# EAGLE design ALU_2 (EAGLE 5.11)
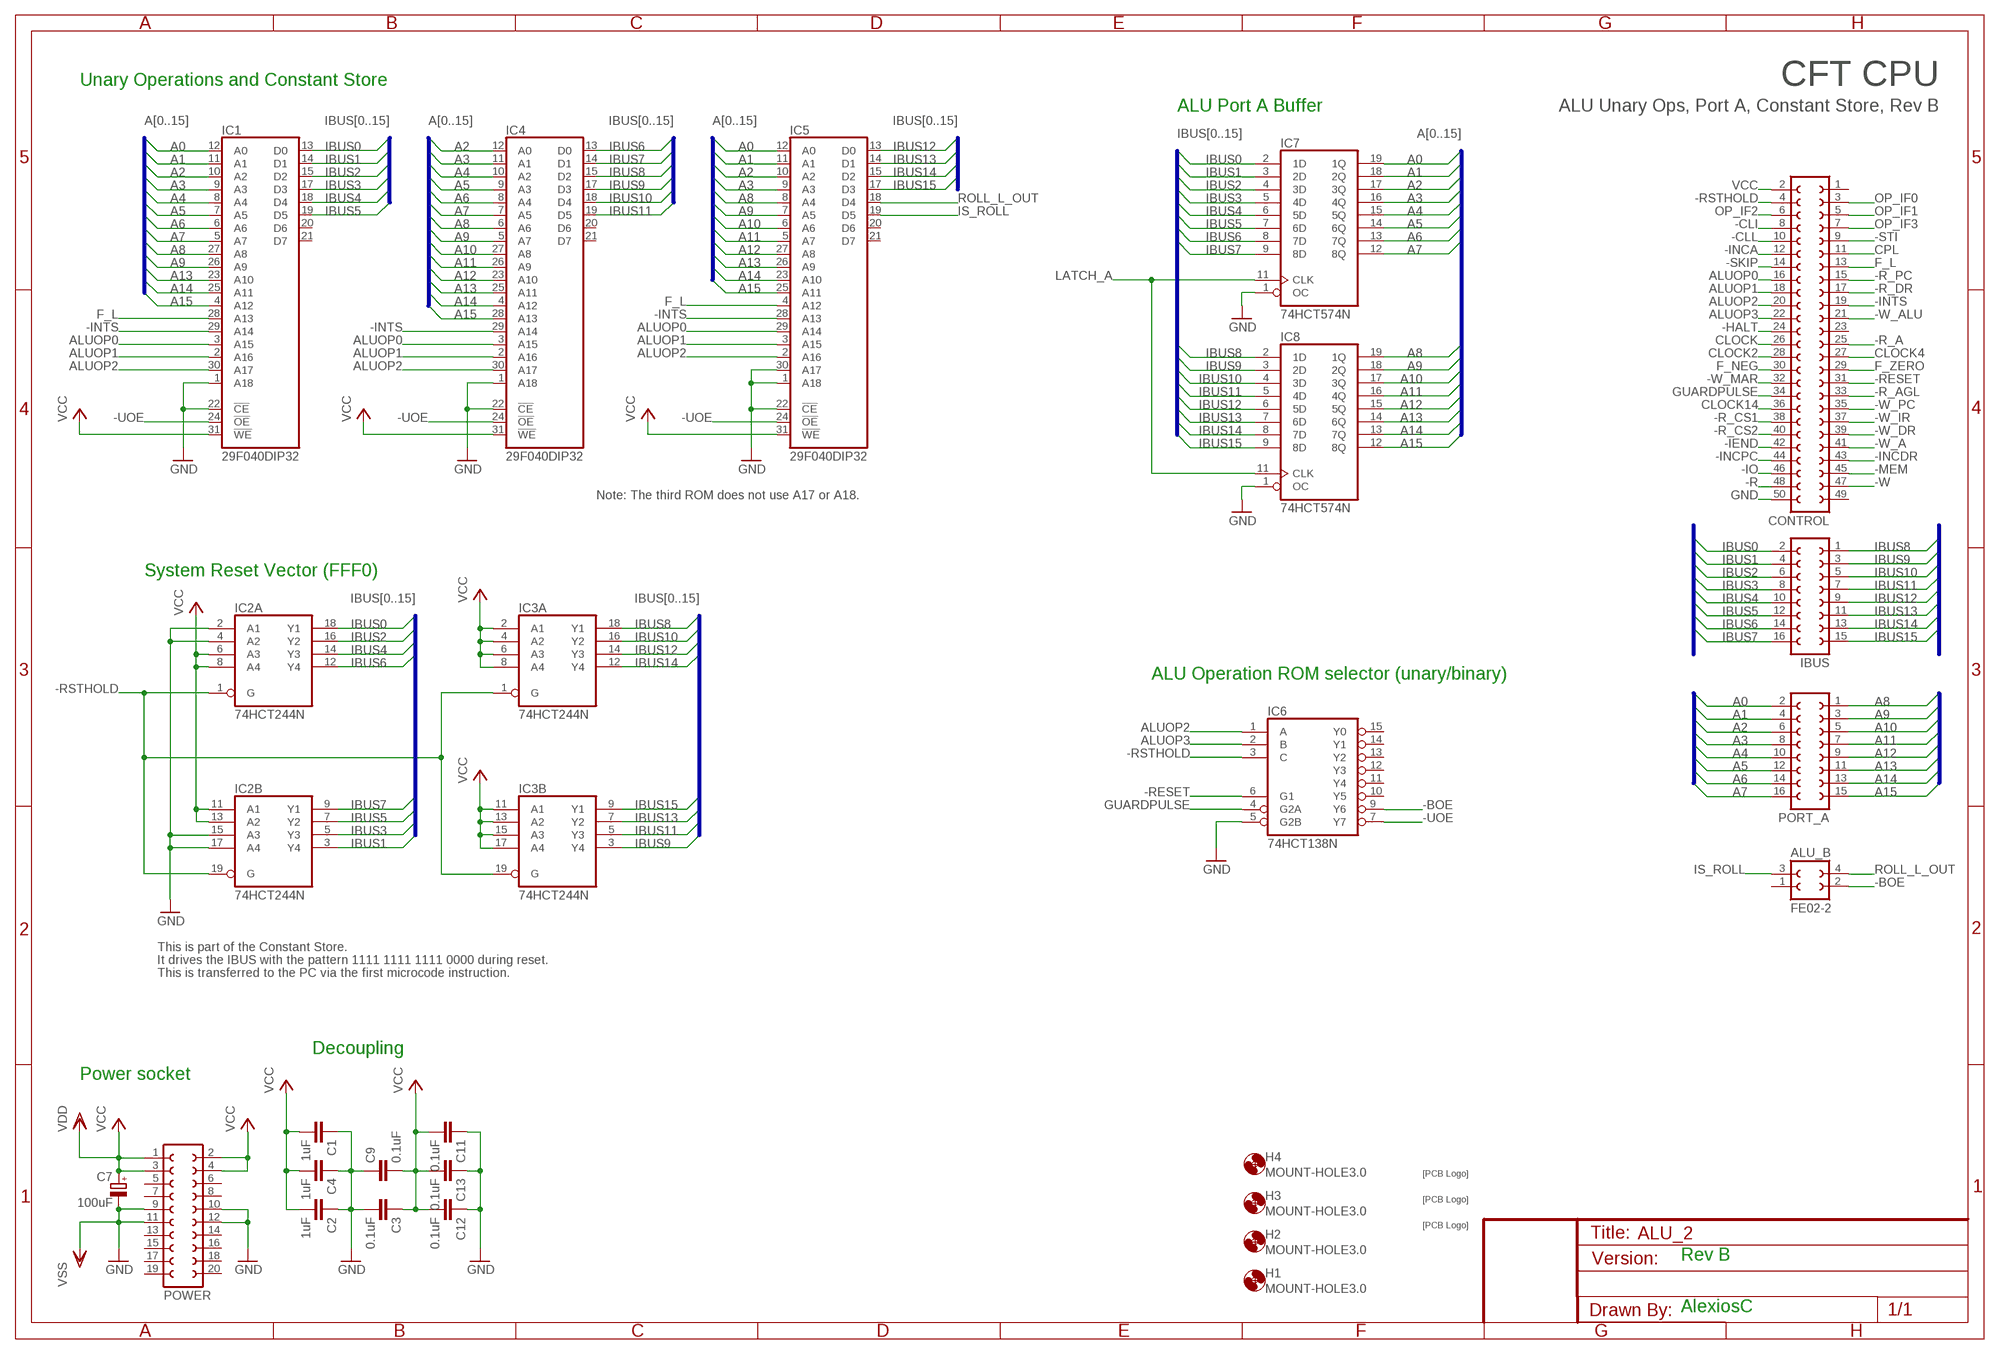
[diagram p0: schematic, sheet 1]

## Parts
ALU_B  FE02-2  [FE02-2]
C1  1uF  C-EU025-025X050  [C025-025X050]
C2  1uF  C-EU025-025X050  [C025-025X050]
C3  0.1uF  C-EU025-025X050  [C025-025X050]
C4  1uF  C-EU025-025X050  [C025-025X050]
C7  100uF  CPOL-EUE2.5-6  [E2,5-6]
C9  0.1uF  C-EU025-025X050  [C025-025X050]
C11  0.1uF  C-EU025-025X050  [C025-025X050]
C12  0.1uF  C-EU025-025X050  [C025-025X050]
C13  0.1uF  C-EU025-025X050  [C025-025X050]
CONTROL  FE25-2  [FE25-2]
H1  MOUNT-HOLE3.0  [3,0]
H2  MOUNT-HOLE3.0  [3,0]
H3  MOUNT-HOLE3.0  [3,0]
H4  MOUNT-HOLE3.0  [3,0]
IBUS  FE08-2  [FE08-2]
IC1  29F040DIP32  [DIL32]
IC2  74HCT244N  [DIL20]
IC3  74HCT244N  [DIL20]
IC4  29F040DIP32  [DIL32]
IC5  29F040DIP32  [DIL32]
IC6  74HCT138N  [DIL16]
IC7  74HCT574N  [DIL20]
IC8  74HCT574N  [DIL20]
PORT_A  FE08-2  [FE08-2]
POWER  FE10-2  [FE10-2]
U$1  SIGNATUREPLANE  [SIGNATURE_PLANE]
U$2  SIGNATUREPLANE  [SIGNATURE_PLANE]
U$3  SIGNATURESILK  [SIGNATURE]

## Nets
-BOE: ALU_B.2 IC6.9(Y6)
-CLI: CONTROL.8
-CLL: CONTROL.10
-HALT: CONTROL.24
-IEND: CONTROL.42
-INCA: CONTROL.12
-INCDR: CONTROL.43
-INCPC: CONTROL.44
-INTS: CONTROL.19 IC1.29(A14) IC4.29(A14) IC5.28(A13)
-IO: CONTROL.46
-MEM: CONTROL.45
-R: CONTROL.48
-R_A: CONTROL.25
-R_AGL: CONTROL.33
-R_CS1: CONTROL.38
-R_CS2: CONTROL.40
-R_DR: CONTROL.17
-R_PC: CONTROL.15
-RESET: CONTROL.31 IC6.6(G1)
-RSTHOLD: CONTROL.4 IC2.1(A:G) IC2.19(B:G) IC3.1(A:G) IC3.19(B:G) IC6.3(C)
-SKIP: CONTROL.14
-STI: CONTROL.9
-UOE: IC1.24(!OE) IC4.24(!OE) IC5.24(!OE) IC6.7(Y7)
-W: CONTROL.47
-W_A: CONTROL.41
-W_ALU: CONTROL.21
-W_DR: CONTROL.39
-W_IR: CONTROL.37
-W_MAR: CONTROL.32
-W_PC: CONTROL.35
A0: IC1.12(A0) IC5.12(A0) IC7.19(1Q) PORT_A.2
A1: IC1.11(A1) IC5.11(A1) IC7.18(2Q) PORT_A.4
A2: IC1.10(A2) IC4.12(A0) IC5.10(A2) IC7.17(3Q) PORT_A.6
A3: IC1.9(A3) IC4.11(A1) IC5.9(A3) IC7.16(4Q) PORT_A.8
A4: IC1.8(A4) IC4.10(A2) IC7.15(5Q) PORT_A.10
A5: IC1.7(A5) IC4.9(A3) IC7.14(6Q) PORT_A.12
A6: IC1.6(A6) IC4.8(A4) IC7.13(7Q) PORT_A.14
A7: IC1.5(A7) IC4.7(A5) IC7.12(8Q) PORT_A.16
A8: IC1.27(A8) IC4.6(A6) IC5.8(A4) IC8.19(1Q) PORT_A.1
A9: IC1.26(A9) IC4.5(A7) IC5.7(A5) IC8.18(2Q) PORT_A.3
A10: IC4.27(A8) IC5.6(A6) IC8.17(3Q) PORT_A.5
A11: IC4.26(A9) IC5.5(A7) IC8.16(4Q) PORT_A.7
A12: IC4.23(A10) IC5.27(A8) IC8.15(5Q) PORT_A.9
A13: IC1.23(A10) IC4.25(A11) IC5.26(A9) IC8.14(6Q) PORT_A.11
A14: IC1.25(A11) IC4.4(A12) IC5.23(A10) IC8.13(7Q) PORT_A.13
A15: IC1.4(A12) IC4.28(A13) IC5.25(A11) IC8.12(8Q) PORT_A.15
ALUOP0: CONTROL.16 IC1.3(A15) IC4.3(A15) IC5.29(A14)
ALUOP1: CONTROL.18 IC1.2(A16) IC4.2(A16) IC5.3(A15)
ALUOP2: CONTROL.20 IC1.30(A17) IC4.30(A17) IC5.2(A16) IC6.1(A)
ALUOP3: CONTROL.22 IC6.2(B)
CLOCK: CONTROL.26
CLOCK2: CONTROL.28
CLOCK4: CONTROL.27
CLOCK14: CONTROL.36
CPL: CONTROL.11
F_L: CONTROL.13 IC1.28(A13) IC5.4(A12)
F_NEG: CONTROL.30
F_ZERO: CONTROL.29
GND: C1.1 C2.1 C3.2 C4.1 C7.- C9.1 C11.1 C12.1 C13.1 CONTROL.50 IC1.1(A18) IC1.22(!CE) IC2.2(A:A1) IC2.4(A:A2) IC2.15(B:A3) IC2.17(B:A4) IC4.1(A18) IC4.22(!CE) IC5.1(A18) IC5.22(!CE) IC5.30(A17) IC6.5(G2B) IC7.1(OC) IC8.1(OC) POWER.9 POWER.10 POWER.11 POWER.12 ; supply symbol labelled VSS
GUARDPULSE: CONTROL.34 IC6.4(G2A)
IBUS0: IBUS.2 IC1.13(D0) IC2.18(A:Y1) IC7.2(1D)
IBUS1: IBUS.4 IC1.14(D1) IC2.3(B:Y4) IC7.3(2D)
IBUS2: IBUS.6 IC1.15(D2) IC2.16(A:Y2) IC7.4(3D)
IBUS3: IBUS.8 IC1.17(D3) IC2.5(B:Y3) IC7.5(4D)
IBUS4: IBUS.10 IC1.18(D4) IC2.14(A:Y3) IC7.6(5D)
IBUS5: IBUS.12 IC1.19(D5) IC2.7(B:Y2) IC7.7(6D)
IBUS6: IBUS.14 IC2.12(A:Y4) IC4.13(D0) IC7.8(7D)
IBUS7: IBUS.16 IC2.9(B:Y1) IC4.14(D1) IC7.9(8D)
IBUS8: IBUS.1 IC3.18(A:Y1) IC4.15(D2) IC8.2(1D)
IBUS9: IBUS.3 IC3.3(B:Y4) IC4.17(D3) IC8.3(2D)
IBUS10: IBUS.5 IC3.16(A:Y2) IC4.18(D4) IC8.4(3D)
IBUS11: IBUS.7 IC3.5(B:Y3) IC4.19(D5) IC8.5(4D)
IBUS12: IBUS.9 IC3.14(A:Y3) IC5.13(D0) IC8.6(5D)
IBUS13: IBUS.11 IC3.7(B:Y2) IC5.14(D1) IC8.7(6D)
IBUS14: IBUS.13 IC3.12(A:Y4) IC5.15(D2) IC8.8(7D)
IBUS15: IBUS.15 IC3.9(B:Y1) IC5.17(D3) IC8.9(8D)
IS_ROLL: ALU_B.3 IC5.19(D5)
LATCH_A: IC7.11(CLK) IC8.11(CLK)
OP_IF0: CONTROL.3
OP_IF1: CONTROL.5
OP_IF2: CONTROL.6
OP_IF3: CONTROL.7
ROLL_L_OUT: ALU_B.4 IC5.18(D4)
VCC: C1.2 C2.2 C3.1 C4.2 C7.+ C9.2 C11.2 C12.2 C13.2 CONTROL.2 IC1.31(!WE) IC2.6(A:A3) IC2.8(A:A4) IC2.11(B:A1) IC2.13(B:A2) IC3.2(A:A1) IC3.4(A:A2) IC3.6(A:A3) IC3.8(A:A4) IC3.11(B:A1) IC3.13(B:A2) IC3.15(B:A3) IC3.17(B:A4) IC4.31(!WE) IC5.31(!WE) POWER.1 POWER.2 POWER.3 POWER.4 ; supply symbol labelled VDD
Unconnected: ALU_B.1 CONTROL.1 CONTROL.23 CONTROL.49 IC1.20(D6) IC1.21(D7) IC4.20(D6) IC4.21(D7) IC5.20(D6) IC5.21(D7) IC6.10(Y5) IC6.11(Y4) IC6.12(Y3) IC6.13(Y2) IC6.14(Y1) IC6.15(Y0) POWER.5 POWER.6 POWER.7 POWER.8 POWER.13 POWER.14 POWER.15 POWER.16 POWER.17 POWER.18 POWER.19 POWER.20

## Buses
IBUS[0..15]
A[0..15]

## Notes on the sheet
- Unary Operations and Constant Store | CFT CPU
- ALU Port A Buffer | ALU Unary Ops, Port A, Constant Store, Rev B
- Note: The third ROM does not use A17 or A18.
- System Reset Vector (FFF0)
- ALU Operation ROM selector (unary/binary)
- This is part of the Constant Store.
- It drives the IBUS with the pattern 1111 1111 1111 0000 during reset.
- This is transferred to the PC via the first microcode instruction.
- Decoupling
- Power socket
- Rev B
- AlexiosC

## Power pins joined to a net without a drawn wire
GND: IC1.16(GND) IC2.10(P:GND) IC3.10(P:GND) IC4.16(GND) IC5.16(GND) IC6.8(GND) IC7.10(GND) IC8.10(GND)
VCC: IC1.32(VCC) IC2.20(P:VCC) IC3.20(P:VCC) IC4.32(VCC) IC5.32(VCC) IC6.16(VCC) IC7.20(VCC) IC8.20(VCC)

## Library data of the parts
ALU_B = alexios:FE02-2: A 2x2 pin female header.
C1-C4 C9 C11-C13 = rcl:C-EU: CAPACITOR, European symbol
C7 = rcl:CPOL-EU: POLARIZED CAPACITOR, European symbol
CONTROL = con-lsta:FE25-2: FEMALE HEADER
H1-H4 = holes:MOUNT-HOLE: MOUNTING HOLE with drill center marker
IBUS PORT_A = con-lsta:FE08-2: FEMALE HEADER
IC1 IC4 IC5 = alexios:29F040: 4-mbit (512x8) Flash memory in a PLCC32 package (with socket). AM29F040 is an example of this.
IC2 IC3 = 74xx-eu:74*244: Octal BUFFER and LINE DRIVER, 3-state
IC6 = 74xx-eu:74*138: 3-line to 8-line DECODER/DEMULTIPLEXER
IC7 IC8 = 74xx-eu:74*574: 8-bit D type FLIP FLOP bus driver
POWER = con-lsta:FE10-2: FEMALE HEADER; OC_FARNELL: unknown; OC_NEWARK: unknown
U$1-U$3 = alexios:SIGNATURE: Soup signature

## Net classes
1 Decoupling: width 1.27 mm

## Board
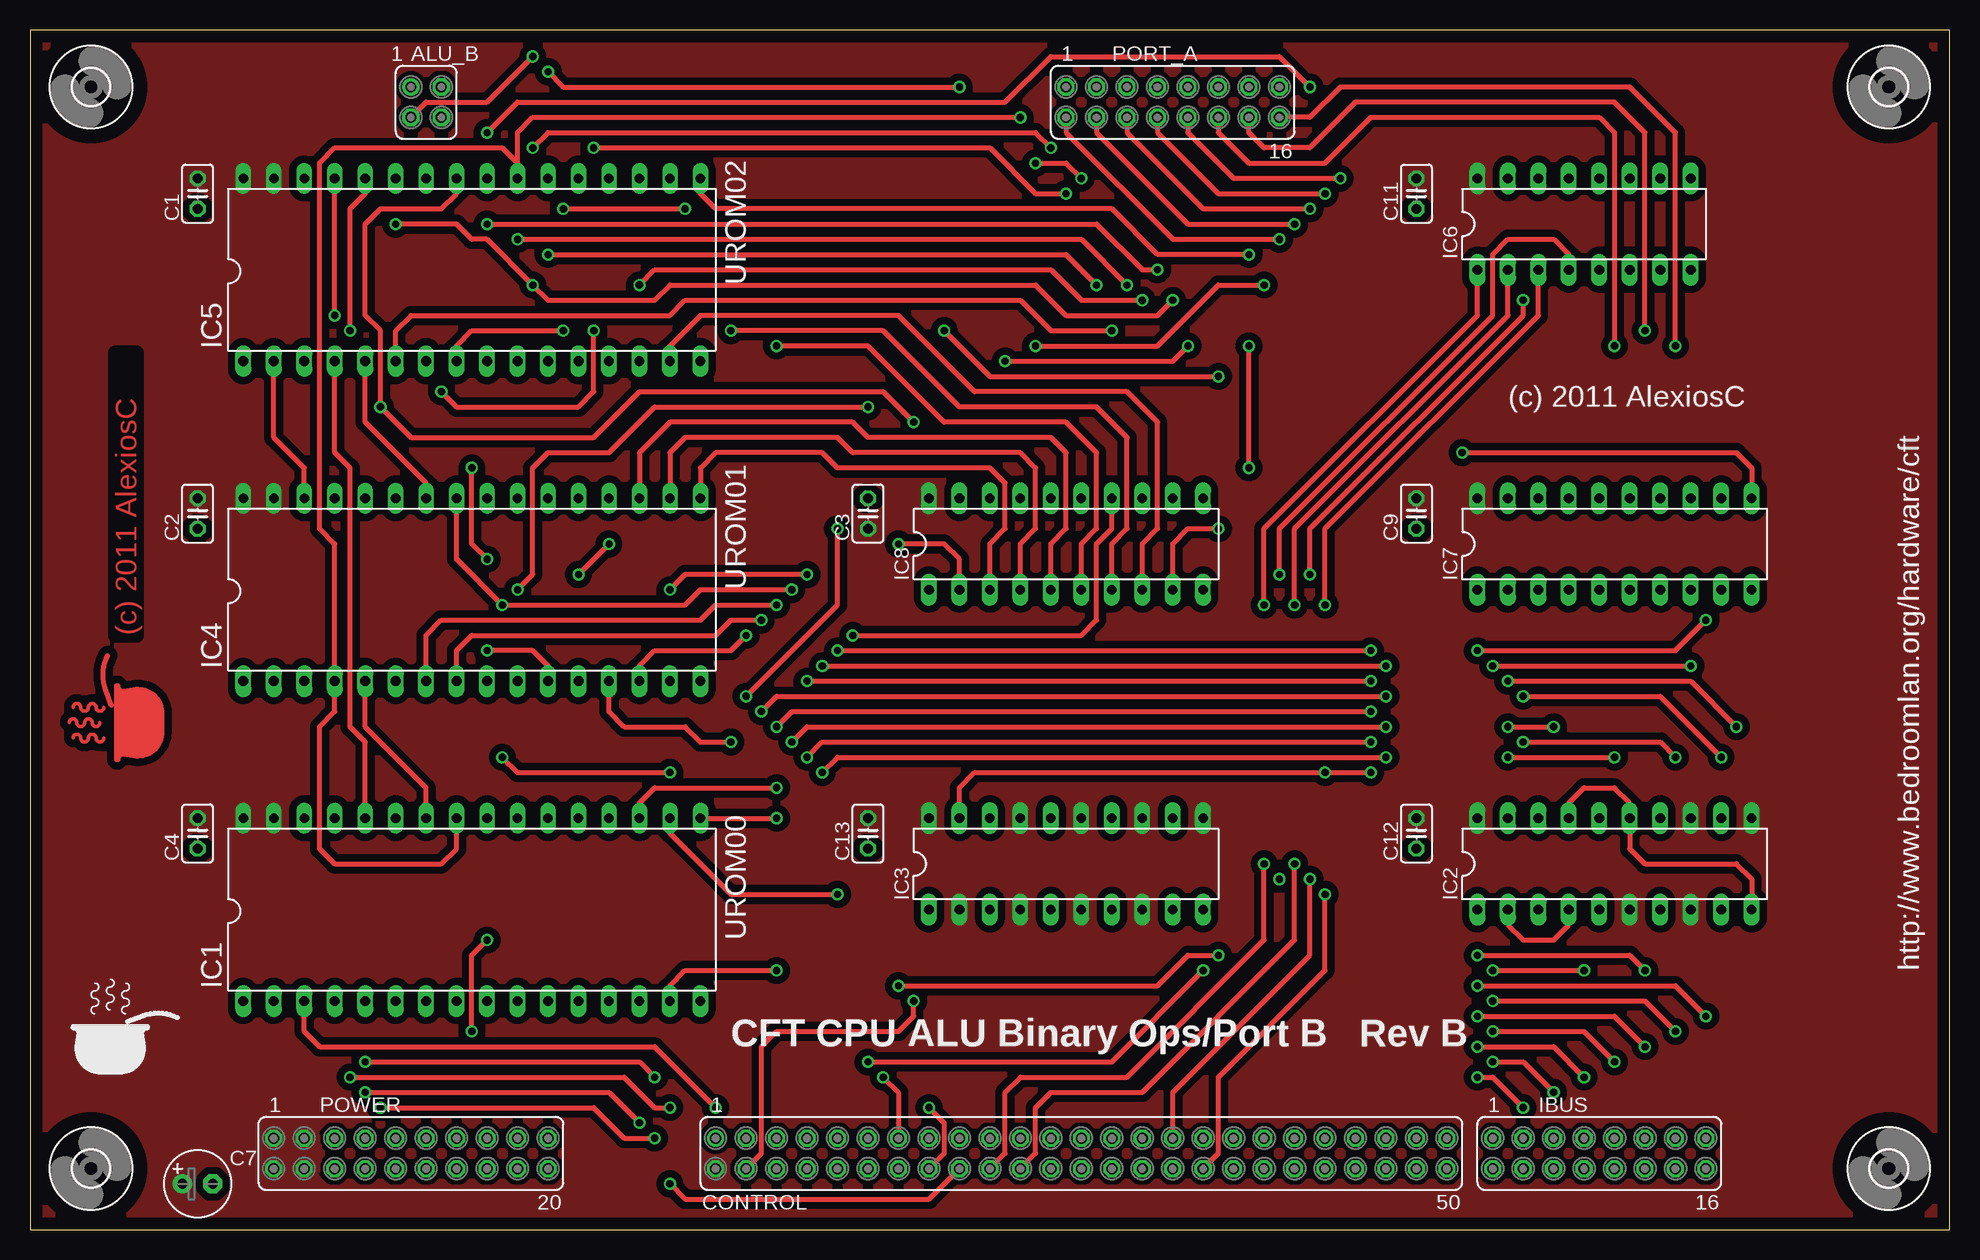
[diagram p1: board, top side]
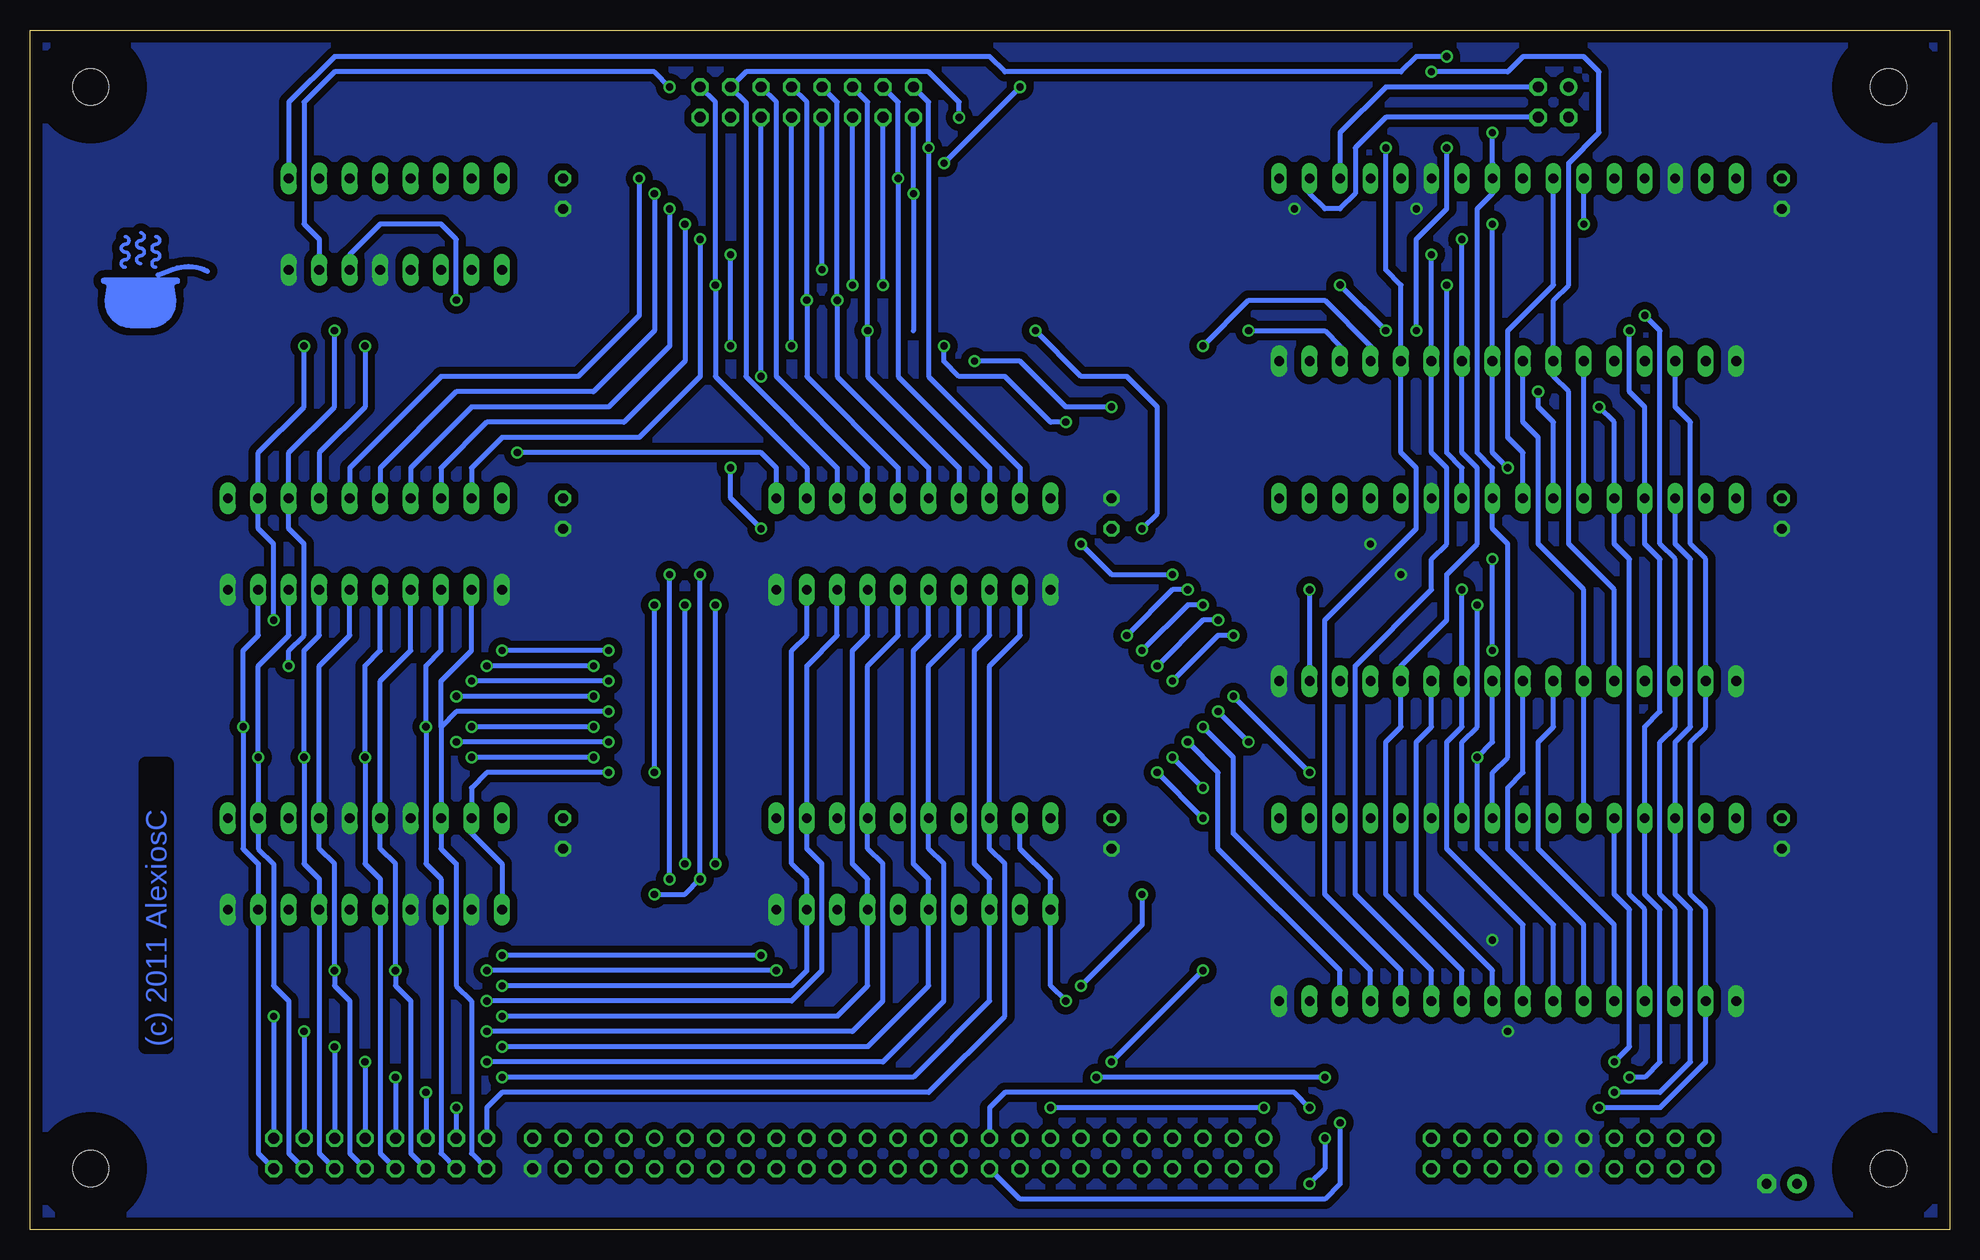
[diagram p2: board, bottom side, seen from below]

Size 160 x 100 mm. Coordinates in mm from the lower left corner, seen from the top.
Outline: 0,0 160,0 160,100 0,100 0,0
Copper layers (1*16): Top 0.035mm / dielectric 1.5mm / Bottom 0.035mm
Design rules "olimex-10mil": minimum track width 10mil, minimum drill 24mil, track to track 10mil, track to pad 10mil, pad to pad 10mil, via to via 10mil, smd to smd 10mil, copper to edge 40mil, drill to drill 10mil, minimum pad ring 10mil, minimum via ring 8mil, stop-mask expansion 0mil, vias tented up to drill 0mil, thermal gap 10mil

### Footprints (pad centres in the part's own frame; a part is rotated, then mirrored left to right if it is on the bottom)
FE02-2 = drill 0.914 round: 1 -1.27,1.27 | drill 0.914 octagon: 2 -1.27,-1.27; 3 1.27,1.27; 4 1.27,-1.27
C025-025X050 = drill 0.813 octagon: 1 -1.27,0; 2 1.27,0
E2,5-6 = drill 0.813 pad 1.6 round: + -1.27,0 | drill 0.813 pad 1.6 octagon: - 1.27,0
FE25-2 = drill 0.914 round: 1 -30.48,1.27; 41 20.32,1.27 | drill 0.914 octagon: 2 -30.48,-1.27; 3 -27.94,1.27; 4 -27.94,-1.27; 5 -25.4,1.27; 6 -25.4,-1.27; 7 -22.86,1.27; 8 -22.86,-1.27; 9 -20.32,1.27; 10 -20.32,-1.27; 11 -17.78,1.27; 12 -17.78,-1.27; 13 -15.24,1.27; 14 -15.24,-1.27; 15 -12.7,1.27; 16 -12.7,-1.27; 17 -10.16,1.27; 18 -10.16,-1.27; 19 -7.62,1.27; 20 -7.62,-1.27; 21 -5.08,1.27; 22 -5.08,-1.27; 23 -2.54,1.27; 24 -2.54,-1.27; 25 0,1.27; 26 0,-1.27; 27 2.54,1.27; 28 2.54,-1.27; 29 5.08,1.27; 30 5.08,-1.27; 31 7.62,1.27; 32 7.62,-1.27; 33 10.16,1.27; 34 10.16,-1.27; 35 12.7,1.27; 36 12.7,-1.27; 37 15.24,1.27; 38 15.24,-1.27; 39 17.78,1.27; 40 17.78,-1.27; 42 20.32,-1.27; 43 22.86,1.27; 44 22.86,-1.27; 45 25.4,1.27; 46 25.4,-1.27; 47 27.94,1.27; 48 27.94,-1.27; 49 30.48,1.27; 50 30.48,-1.27
3,0 = hole 3: 0,0
FE08-2 = drill 0.914 octagon: 1 -8.89,1.27; 2 -8.89,-1.27; 3 -6.35,1.27; 4 -6.35,-1.27; 5 -3.81,1.27; 6 -3.81,-1.27; 7 -1.27,1.27; 8 -1.27,-1.27; 9 1.27,1.27; 10 1.27,-1.27; 11 3.81,1.27; 12 3.81,-1.27; 13 6.35,1.27; 14 6.35,-1.27; 15 8.89,1.27; 16 8.89,-1.27
DIL32 = drill 0.813 long: 1 -19.05,-7.62; 2 -16.51,-7.62; 3 -13.97,-7.62; 4 -11.43,-7.62; 5 -8.89,-7.62; 6 -6.35,-7.62; 7 -3.81,-7.62; 8 -1.27,-7.62; 9 1.27,-7.62; 10 3.81,-7.62; 11 6.35,-7.62; 12 8.89,-7.62; 13 11.43,-7.62; 14 13.97,-7.62; 15 16.51,-7.62; 16 19.05,-7.62 | drill 0.8 long: 17 19.05,7.62; 18 16.51,7.62; 19 13.97,7.62; 20 11.43,7.62; 21 8.89,7.62; 22 6.35,7.62; 23 3.81,7.62; 24 1.27,7.62; 25 -1.27,7.62; 26 -3.81,7.62; 27 -6.35,7.62; 28 -8.89,7.62; 29 -11.43,7.62; 30 -13.97,7.62; 31 -16.51,7.62; 32 -19.05,7.62
DIL20 = drill 0.813 long: 1 -11.43,-3.81; 2 -8.89,-3.81; 3 -6.35,-3.81; 4 -3.81,-3.81; 5 -1.27,-3.81; 6 1.27,-3.81; 7 3.81,-3.81; 8 6.35,-3.81; 9 8.89,-3.81; 10 11.43,-3.81; 11 11.43,3.81; 12 8.89,3.81; 13 6.35,3.81; 14 3.81,3.81; 15 1.27,3.81; 16 -1.27,3.81; 17 -3.81,3.81; 18 -6.35,3.81; 19 -8.89,3.81; 20 -11.43,3.81
DIL16 = drill 0.813 long: 1 -8.89,-3.81; 2 -6.35,-3.81; 3 -3.81,-3.81; 4 -1.27,-3.81; 5 1.27,-3.81; 6 3.81,-3.81; 7 6.35,-3.81; 8 8.89,-3.81; 9 8.89,3.81; 10 6.35,3.81; 11 3.81,3.81; 12 1.27,3.81; 13 -1.27,3.81; 14 -3.81,3.81; 15 -6.35,3.81; 16 -8.89,3.81
FE10-2 = drill 0.914 octagon: 1 -11.43,1.27; 2 -11.43,-1.27; 3 -8.89,1.27; 4 -8.89,-1.27; 5 -6.35,1.27; 6 -6.35,-1.27; 7 -3.81,1.27; 8 -3.81,-1.27; 9 -1.27,1.27; 10 -1.27,-1.27; 11 1.27,1.27; 12 1.27,-1.27; 13 3.81,1.27; 14 3.81,-1.27; 15 6.35,1.27; 16 6.35,-1.27; 17 8.89,1.27; 18 8.89,-1.27; 19 11.43,1.27; 20 11.43,-1.27

### Placement (x,y rotation side)
ALU_B  33.02,93.98 0 top
C1  13.97,86.36 90 top
C2  13.97,59.69 90 top
C3  69.85,59.69 90 top
C4  13.97,33.02 90 top
C7  13.97,3.81 0 top
C9  115.57,59.69 90 top
C11  115.57,86.36 90 top
C12  115.57,33.02 90 top
C13  69.85,33.02 90 top
CONTROL  87.63,6.35 0 top
H1  154.94,95.25 0 top
H2  154.94,5.08 0 top
H3  5.08,5.08 0 top
H4  5.08,95.25 0 top
IBUS  130.81,6.35 0 top
IC1  36.83,26.67 0 top
IC2  132.08,30.48 0 top
IC3  86.36,30.48 0 top
IC4  36.83,53.34 0 top
IC5  36.83,80.01 0 top
IC6  129.54,83.82 0 top
IC7  132.08,57.15 0 top
IC8  86.36,57.15 0 top
PORT_A  95.25,93.98 0 top
POWER  31.75,6.35 0 top
U$1  11.43,39.37 90 top
U$2  153.67,74.93 0 bottom
U$3  3.81,12.7 0 top

### Tracks (layer width: path | path; a pad name or v marks a point on that pad's centre or on a via)
-BOE  (via drill 0.6)
  Top 0.406: v41.91,97.79 38.1,93.98 33.02,93.98 ALU_B.2
  Bottom 0.406: IC6.9 138.43,93.98 134.62,97.79 80.01,97.79 78.74,96.52 45.72,96.52 44.45,97.79 v41.91,97.79
-INTS  (via drill 0.6)
  Top 0.406: v26.67,12.7 49.53,12.7 52.07,10.16 v53.34,10.16 | v26.67,74.93 26.67,85.09 27.94,86.36 IC5.28
  Bottom 0.406: CONTROL.19 80.01,10.16 78.74,11.43 54.61,11.43 v53.34,10.16 | v26.67,12.7 25.4,12.7 24.13,13.97 24.13,26.67 25.4,27.94 IC1.29 25.4,41.91 24.13,43.18 24.13,55.88 25.4,57.15 IC4.29 25.4,68.58 26.67,69.85 v26.67,74.93
-RESET  (via drill 0.6)
  Top 0.406: v106.68,29.21 106.68,22.86 95.25,11.43 CONTROL.31 | v106.68,54.61 106.68,58.42 124.46,76.2 v124.46,77.47
  Bottom 0.406: v106.68,29.21 v106.68,54.61 | IC6.6 133.35,81.28 130.81,83.82 125.73,83.82 124.46,82.55 v124.46,77.47
-RSTHOLD  (via drill 0.6)
  Top 0.406: CONTROL.4 60.96,6.35 60.96,15.24 62.23,16.51 72.39,16.51 73.66,17.78 v73.66,19.05 | v111.76,38.1 v107.95,38.1 78.74,38.1 77.47,36.83 IC3.19 | IC6.3 125.73,76.2 107.95,58.42 v107.95,52.07
  Bottom 0.406: IC2.1 120.65,30.48 123.19,33.02 IC2.19 123.19,36.83 121.92,38.1 v111.76,38.1 | v73.66,19.05 74.93,20.32 IC3.1 74.93,29.21 77.47,31.75 IC3.19 | v107.95,38.1 v107.95,52.07
-UOE  (via drill 0.6)
  Top 0.406: v106.68,95.25 104.14,97.79 85.09,97.79 81.28,93.98 40.64,93.98 v38.1,91.44
  Bottom 0.406: IC1.24 38.1,38.1 36.83,39.37 36.83,57.15 38.1,58.42 IC4.24 38.1,63.5 39.37,64.77 39.37,85.09 38.1,86.36 IC5.24 | IC5.24 38.1,88.9 | v106.68,95.25 107.95,96.52 134.62,96.52 137.16,93.98 137.16,83.82 135.89,82.55 IC6.7 | IC5.24 v38.1,91.44
A0  (via drill 0.6)
  Top 0.406: PORT_A.2 86.36,91.44 95.25,82.55 v104.14,82.55 | v46.99,90.17 80.01,90.17 83.82,86.36 v86.36,86.36
  Bottom 0.406: IC1.12 45.72,21.59 52.07,27.94 52.07,50.8 44.45,58.42 44.45,63.5 45.72,64.77 IC5.12 45.72,78.74 46.99,80.01 v46.99,90.17 | IC7.19 123.19,63.5 120.65,66.04 109.22,66.04 104.14,71.12 v104.14,82.55 | 86.36,74.93 v86.36,86.36 PORT_A.2
A1  (via drill 0.6)
  Top 0.406: PORT_A.4 88.9,91.44 96.52,83.82 v105.41,83.82 | v43.18,81.28 86.36,81.28 v88.9,78.74
  Bottom 0.406: IC1.11 43.18,21.59 49.53,27.94 49.53,46.99 43.18,53.34 43.18,55.88 41.91,57.15 41.91,63.5 43.18,64.77 IC5.11 v43.18,81.28 | IC7.18 125.73,63.5 121.92,67.31 110.49,67.31 105.41,72.39 v105.41,83.82 | v88.9,78.74 PORT_A.4
A2  (via drill 0.6)
  Top 0.406: PORT_A.6 91.44,91.44 97.79,85.09 v106.68,85.09 | v40.64,82.55 87.63,82.55 v91.44,78.74
  Bottom 0.406: IC1.10 40.64,21.59 46.99,27.94 46.99,40.64 45.72,41.91 IC4.12 45.72,46.99 41.91,50.8 41.91,54.61 39.37,57.15 39.37,63.5 40.64,64.77 IC5.10 v40.64,82.55 | IC7.17 128.27,63.5 123.19,68.58 111.76,68.58 106.68,73.66 v106.68,85.09 | v91.44,78.74 PORT_A.6
A3  (via drill 0.6)
  Top 0.406: v38.1,55.88 36.83,57.15 v36.83,63.5 | PORT_A.8 93.98,91.44 99.06,86.36 v107.95,86.36 | v38.1,83.82 88.9,83.82 92.71,80.01 v93.98,80.01 | v38.1,48.26 41.91,48.26 43.18,46.99 IC4.11
  Bottom 0.406: IC1.9 38.1,21.59 44.45,27.94 44.45,40.64 43.18,41.91 IC4.11 | v36.83,63.5 38.1,64.77 IC5.9 v38.1,83.82 | IC7.16 130.81,63.5 124.46,69.85 113.03,69.85 107.95,74.93 v107.95,86.36 | v93.98,80.01 PORT_A.8 | v38.1,48.26 v38.1,55.88
A4  (via drill 0.6)
  Top 0.406: PORT_A.10 96.52,91.44 100.33,87.63 v109.22,87.63 | v96.52,73.66 95.25,72.39 v81.28,72.39 | v69.85,68.58 52.07,68.58 48.26,64.77 43.18,64.77 41.91,63.5 41.91,54.61 v40.64,53.34
  Bottom 0.406: IC1.8 35.56,25.4 41.91,31.75 41.91,40.64 40.64,41.91 IC4.10 v40.64,53.34 | IC7.15 133.35,63.5 125.73,71.12 114.3,71.12 109.22,76.2 v109.22,87.63 | v96.52,73.66 PORT_A.10 | v69.85,68.58 73.66,68.58 77.47,72.39 v81.28,72.39
A5  (via drill 0.6)
  Top 0.406: PORT_A.12 99.06,91.44 101.6,88.9 107.95,88.9 111.76,92.71 130.81,92.71 132.08,91.44 v132.08,73.66 | v76.2,74.93 80.01,71.12 v99.06,71.12 | v39.37,39.37 40.64,38.1 v53.34,38.1 | v59.69,44.45 67.31,52.07 v67.31,58.42
  Bottom 0.406: IC1.7 33.02,25.4 39.37,31.75 v39.37,39.37 38.1,40.64 IC4.9 | IC7.14 135.89,64.77 132.08,68.58 v132.08,73.66 | v99.06,71.12 PORT_A.12 | v53.34,38.1 v59.69,44.45 | v67.31,58.42 66.04,59.69 66.04,68.58 68.58,71.12 72.39,71.12 v76.2,74.93
A6  (via drill 0.6)
  Top 0.406: v134.62,74.93 134.62,91.44 132.08,93.98 110.49,93.98 106.68,90.17 102.87,90.17 101.6,91.44 PORT_A.14 | IC4.8 35.56,48.26 36.83,49.53 57.15,49.53 58.42,50.8 v60.96,50.8 | v66.04,46.99 v113.03,46.99 | v121.92,46.99 v138.43,46.99
  Bottom 0.406: IC1.6 30.48,25.4 36.83,31.75 36.83,36.83 35.56,38.1 IC4.8 | v134.62,74.93 134.62,68.58 138.43,64.77 IC7.13 138.43,58.42 137.16,57.15 137.16,49.53 138.43,48.26 v138.43,46.99 | v60.96,50.8 62.23,50.8 v66.04,46.99 | v113.03,46.99 v121.92,46.99
A7  (via drill 0.6)
  Top 0.406: PORT_A.16 106.68,92.71 109.22,95.25 133.35,95.25 137.16,91.44 v137.16,73.66 | IC4.7 33.02,49.53 34.29,50.8 55.88,50.8 57.15,52.07 v62.23,52.07 | v139.7,50.8 137.16,48.26 v120.65,48.26 | v67.31,48.26 v111.76,48.26
  Bottom 0.406: IC1.5 27.94,25.4 34.29,31.75 34.29,40.64 33.02,41.91 IC4.7 | v137.16,73.66 137.16,68.58 140.97,64.77 IC7.12 140.97,58.42 139.7,57.15 v139.7,50.8 | v62.23,52.07 63.5,52.07 v67.31,48.26 | v111.76,48.26 v120.65,48.26
A8  (via drill 0.6)
  Top 0.406: v44.45,74.93 36.83,74.93 35.56,73.66 IC5.8 | v41.91,90.17 43.18,91.44 83.82,91.44 v85.09,90.17
  Bottom 0.406: IC1.27 IC4.6 30.48,53.34 34.29,57.15 34.29,66.04 35.56,67.31 IC5.8 | PORT_A.1 85.09,93.98 v85.09,90.17 85.09,71.12 77.47,63.5 IC8.19 | v44.45,74.93 44.45,82.55 41.91,85.09 v41.91,90.17
A9  (via drill 0.6)
  Top 0.406: IC1.26 33.02,36.83 27.94,41.91 IC4.5 | v83.82,88.9 86.36,88.9 v87.63,87.63 | v43.18,96.52 44.45,95.25 v77.47,95.25
  Bottom 0.406: IC4.5 27.94,53.34 31.75,57.15 31.75,69.85 33.02,71.12 IC5.7 33.02,77.47 31.75,78.74 31.75,88.9 29.21,91.44 29.21,96.52 30.48,97.79 35.56,97.79 36.83,96.52 v43.18,96.52 | PORT_A.3 87.63,93.98 v87.63,87.63 87.63,71.12 80.01,63.5 IC8.18 | v77.47,95.25 v83.82,88.9
A10  (via drill 0.6)
  Top 0.406: v90.17,74.93 85.09,74.93 82.55,77.47 54.61,77.47 53.34,76.2 31.75,76.2 30.48,74.93 IC5.6
  Bottom 0.406: IC4.27 IC5.6 | PORT_A.5 90.17,93.98 v90.17,74.93 90.17,71.12 82.55,63.5 IC8.17
A11  (via drill 0.61)
  Top 0.406: IC4.26 33.02,62.23 27.94,67.31 IC5.5 | v34.29,69.85 35.56,68.58 45.72,68.58 46.99,69.85 v46.99,74.93 | v50.8,78.74 52.07,80.01 85.09,80.01 87.63,77.47 v92.71,77.47
  Bottom 0.406: PORT_A.7 92.71,93.98 v92.71,77.47 92.71,71.12 85.09,63.5 IC8.16 | IC4.26 33.02,67.31 34.29,68.58 v34.29,69.85 | v46.99,74.93 v50.8,78.74
A12  (via drill 0.6)
  Top 0.406: v30.48,83.82 35.56,83.82 36.83,82.55 38.1,82.55 v41.91,78.74 43.18,77.47 52.07,77.47 53.34,78.74 83.82,78.74 86.36,76.2 93.98,76.2 v95.25,77.47
  Bottom 0.406: IC4.23 40.64,63.5 41.91,64.77 v41.91,78.74 | v30.48,83.82 IC5.27 | PORT_A.9 95.25,93.98 v95.25,77.47 95.25,71.12 87.63,63.5 IC8.15
A13  (via drill 0.6)
  Top 0.406: IC4.25 35.56,55.88 v39.37,52.07 54.61,52.07 55.88,53.34 v63.5,53.34 | v68.58,49.53 87.63,49.53 88.9,50.8 88.9,57.15 90.17,58.42 IC8.14
  Bottom 0.406: IC1.23 40.64,40.64 39.37,41.91 v39.37,52.07 | IC4.25 35.56,64.77 36.83,66.04 36.83,74.93 33.02,78.74 IC5.26 | PORT_A.11 97.79,93.98 97.79,71.12 90.17,63.5 IC8.14 | v63.5,53.34 64.77,53.34 v68.58,49.53
A14  (via drill 0.6)
  Top 0.406: IC1.25 35.56,31.75 34.29,30.48 25.4,30.48 24.13,31.75 24.13,41.91 25.4,43.18 IC4.4 25.4,57.15 24.13,58.42 24.13,88.9 25.4,90.17 39.37,90.17 40.64,88.9 | 40.64,88.9 IC5.23 | 40.64,88.9 40.64,91.44 41.91,92.71 v82.55,92.71
  Bottom 0.406: IC8.13 92.71,63.5 100.33,71.12 100.33,93.98 PORT_A.13 100.33,96.52 85.09,96.52 82.55,93.98 v82.55,92.71
A15  (via drill 0.6)
  Top 0.406: IC5.25 35.56,86.36 34.29,85.09 29.21,85.09 27.94,83.82 27.94,76.2 29.21,74.93 v29.21,68.58 31.75,66.04 46.99,66.04 50.8,69.85 71.12,69.85 v73.66,67.31 | v83.82,73.66 93.98,73.66 99.06,78.74 v102.87,78.74
  Bottom 0.406: IC1.4 25.4,26.67 26.67,27.94 26.67,55.88 27.94,57.15 IC4.28 27.94,67.31 v29.21,68.58 | IC8.12 95.25,63.5 102.87,71.12 v102.87,78.74 102.87,93.98 PORT_A.15 | v83.82,73.66 83.82,72.39 82.55,71.12 78.74,71.12 74.93,67.31 v73.66,67.31
ALUOP0  (via drill 0.6)
  Top 0.406: CONTROL.16 76.2,6.35 76.2,8.89 v74.93,10.16 | v57.15,10.16 52.07,15.24 24.13,15.24 22.86,16.51 IC1.3 | v25.4,76.2 IC5.29
  Bottom 0.406: IC1.3 22.86,26.67 24.13,27.94 24.13,40.64 22.86,41.91 IC4.3 22.86,55.88 24.13,57.15 24.13,74.93 v25.4,76.2 | v57.15,10.16 v74.93,10.16
ALUOP1  (via drill 0.6)
  Top 0.406: CONTROL.18 74.93,2.54 54.61,2.54 v53.34,3.81 | v29.21,10.16 46.99,10.16 49.53,7.62 v52.07,7.62
  Bottom 0.406: IC5.3 22.86,68.58 21.59,67.31 21.59,57.15 20.32,55.88 IC4.2 20.32,41.91 21.59,40.64 21.59,27.94 20.32,26.67 IC1.2 20.32,13.97 24.13,10.16 v29.21,10.16 | v52.07,7.62 52.07,5.08 v53.34,3.81
ALUOP2  (via drill 0.6)
  Top 0.406: IC4.30 22.86,63.5 20.32,66.04 IC5.2 | CONTROL.20 81.28,6.35 81.28,11.43 82.55,12.7 91.44,12.7 102.87,24.13 v102.87,30.48 | IC6.1 120.65,76.2 102.87,58.42 v102.87,52.07 | v27.94,11.43 48.26,11.43 v50.8,8.89
  Bottom 0.406: IC4.30 22.86,57.15 21.59,55.88 21.59,41.91 22.86,40.64 IC1.30 22.86,27.94 21.59,26.67 21.59,13.97 24.13,11.43 v27.94,11.43 | v50.8,8.89 50.8,3.81 52.07,2.54 77.47,2.54 CONTROL.20 | v102.87,30.48 v102.87,52.07
ALUOP3  (via drill 0.6)
  Top 0.406: CONTROL.22 83.82,6.35 83.82,10.16 85.09,11.43 92.71,11.43 105.41,24.13 v105.41,30.48 | v105.41,52.07 105.41,58.42 123.19,76.2 IC6.2
  Bottom 0.406: v105.41,30.48 v105.41,52.07
F_L  (via drill 0.6)
  Top 0.406: IC1.28 27.94,40.64 26.67,41.91 26.67,63.5 25.4,64.77 IC5.4 | v71.12,12.7 72.39,11.43 72.39,8.89 CONTROL.13 | v27.94,13.97 50.8,13.97 v52.07,12.7
  Bottom 0.406: IC1.28 27.94,27.94 26.67,26.67 26.67,15.24 v27.94,13.97 | v52.07,12.7 v71.12,12.7
GND  (via drill 0.6)
  Top 0.406: v36.83,16.51 36.83,22.86 v38.1,24.13 | IC2.17 128.27,35.56 129.54,36.83 132.08,36.83 133.35,35.56 IC2.15 133.35,31.75 134.62,30.48 142.24,30.48 143.51,29.21 IC2.10 | IC2.2 123.19,25.4 124.46,24.13 127,24.13 128.27,25.4 IC2.4 | v44.45,85.09 v54.61,85.09 | v45.72,54.61 v48.26,57.15
  pour Bottom (isolate 0.508, no thermals): 30.48,8.89 29.21,7.62 29.21,5.08 30.48,3.81 33.02,3.81 34.29,5.08 34.29,7.62 33.02,8.89
  pour Bottom (isolate 0.61, no thermals): 0,100.33 0,0 160.02,0 160.02,100.33
GUARDPULSE  (via drill 0.6)
  Top 0.406: CONTROL.34 99.06,6.35 99.06,12.7 107.95,21.59 v107.95,27.94 | IC6.4 128.27,81.28 127,82.55 123.19,82.55 121.92,81.28 121.92,76.2 104.14,58.42 v104.14,54.61
  Bottom 0.406: v104.14,54.61 v104.14,29.21 105.41,27.94 v107.95,27.94
IBUS0  (via drill 0.6)
  Top 0.406: v62.23,41.91 63.5,43.18 v111.76,43.18
  Bottom 0.406: IBUS.2 123.19,6.35 123.19,19.05 124.46,20.32 124.46,30.48 125.73,31.75 IC2.18 125.73,41.91 | 125.73,41.91 125.73,45.72 123.19,48.26 IC7.2 | IC1.13 48.26,21.59 59.69,33.02 59.69,39.37 v62.23,41.91 | v111.76,43.18 124.46,43.18 125.73,41.91
IBUS1  (via drill 0.6)
  Top 0.406: v63.5,40.64 64.77,41.91 v113.03,41.91 | v123.19,41.91 v127,41.91
  Bottom 0.406: IBUS.4 125.73,6.35 IC2.3 125.73,29.21 127,30.48 v127,41.91 127,46.99 125.73,48.26 IC7.3 | IC1.14 50.8,21.59 60.96,31.75 60.96,38.1 v63.5,40.64 | v113.03,41.91 v123.19,41.91
IBUS2  (via drill 0.6)
  Top 0.406: v97.79,21.59 90.17,13.97 v69.85,13.97 | v121.92,21.59 v129.54,21.59 | IC1.15 53.34,20.32 54.61,21.59 v62.23,21.59
  Bottom 0.406: IBUS.6 128.27,6.35 128.27,19.05 129.54,20.32 v129.54,21.59 129.54,30.48 130.81,31.75 IC2.16 130.81,45.72 128.27,48.26 IC7.4 | v97.79,21.59 v121.92,21.59 | v62.23,21.59 v69.85,13.97
IBUS3  (via drill 0.6)
  Top 0.406: IC1.17 v62.23,34.29 | v66.04,38.1 67.31,39.37 v113.03,39.37 | v123.19,39.37 v132.08,39.37
  Bottom 0.406: IBUS.8 130.81,6.35 IC2.5 130.81,29.21 132.08,30.48 v132.08,39.37 132.08,46.99 130.81,48.26 IC7.5 | v62.23,34.29 v66.04,38.1 | v113.03,39.37 v123.19,39.37
IBUS4  (via drill 0.6)
  Top 0.406: IC1.18 53.34,33.02 58.42,27.94 v67.31,27.94 | v72.39,20.32 93.98,20.32 96.52,22.86 v99.06,22.86 | v120.65,22.86 133.35,22.86 v134.62,21.59
  Bottom 0.406: IBUS.10 133.35,6.35 133.35,19.05 134.62,20.32 v134.62,21.59 134.62,30.48 135.89,31.75 IC2.14 135.89,46.99 133.35,49.53 IC7.6 | v99.06,22.86 v120.65,22.86 | v67.31,27.94 67.31,25.4 v72.39,20.32
IBUS5  (via drill 0.6)
  Top 0.406: IC1.19 50.8,35.56 52.07,36.83 v62.23,36.83 | v64.77,39.37 66.04,40.64 v111.76,40.64 | v137.16,39.37 135.89,40.64 v124.46,40.64
  Bottom 0.406: IBUS.12 135.89,6.35 IC2.7 135.89,29.21 137.16,30.48 v137.16,39.37 137.16,48.26 135.89,49.53 IC7.7 | v62.23,36.83 v64.77,39.37 | v111.76,40.64 v124.46,40.64
IBUS6  (via drill 0.6)
  Top 0.406: IC4.13 48.26,43.18 49.53,41.91 54.61,41.91 55.88,40.64 v58.42,40.64 | v60.96,43.18 62.23,44.45 v113.03,44.45 | v140.97,39.37 135.89,44.45 v124.46,44.45
  Bottom 0.406: IBUS.14 138.43,6.35 138.43,19.05 139.7,20.32 139.7,30.48 140.97,31.75 IC2.12 v140.97,39.37 140.97,46.99 138.43,49.53 IC7.8 | v58.42,40.64 v60.96,43.18 | v113.03,44.45 v124.46,44.45
IBUS7  (via drill 0.6)
  Top 0.406: IC4.14 50.8,46.99 52.07,48.26 58.42,48.26 v59.69,49.53 | v142.24,41.91 138.43,45.72 v123.19,45.72 | v64.77,45.72 v111.76,45.72
  Bottom 0.406: IBUS.16 140.97,6.35 IC2.9 140.97,30.48 142.24,31.75 v142.24,41.91 142.24,48.26 140.97,49.53 IC7.9 | v59.69,49.53 60.96,49.53 v64.77,45.72 | v111.76,45.72 v123.19,45.72
IBUS8  (via drill 0.6)
  Top 0.406: v53.34,53.34 54.61,54.61 v64.77,54.61 | v72.39,57.15 76.2,57.15 77.47,55.88 IC8.2
  Bottom 0.406: IC8.2 77.47,49.53 80.01,46.99 IC3.18 80.01,31.75 78.74,30.48 78.74,17.78 85.09,11.43 120.65,11.43 121.92,10.16 IBUS.1 | v53.34,53.34 IC4.15 | v72.39,57.15 69.85,54.61 v64.77,54.61
IBUS9  (via drill 0.6)
  Top 0.254: IC8.3 80.01,54.61
  Top 0.406: v120.65,12.7 121.92,12.7 v124.46,10.16 | IC4.17 55.88,63.5 57.15,64.77 66.04,64.77 67.31,63.5 80.01,63.5 81.28,62.23 81.28,58.42 80.01,57.15 IC8.3
  Bottom 0.406: IC8.3 80.01,49.53 81.28,48.26 81.28,30.48 80.01,29.21 IC3.3 80.01,19.05 86.36,12.7 v120.65,12.7 | v124.46,10.16 IBUS.3
IBUS10  (via drill 0.6)
  Top 0.406: v121.92,13.97 124.46,13.97 v127,11.43 | IC4.18 53.34,64.77 54.61,66.04 67.31,66.04 68.58,64.77 82.55,64.77 83.82,63.5 83.82,58.42 82.55,57.15 IC8.4
  Bottom 0.406: IC8.4 82.55,49.53 85.09,46.99 IC3.16 85.09,31.75 83.82,30.48 83.82,19.05 88.9,13.97 v121.92,13.97 | v127,11.43 IBUS.5
IBUS11  (via drill 0.6)
  Top 0.406: v120.65,15.24 127,15.24 v129.54,12.7 | IC8.5 85.09,57.15 86.36,58.42 86.36,64.77 85.09,66.04 69.85,66.04 68.58,67.31 53.34,67.31 50.8,64.77 IC4.19
  Bottom 0.406: IC8.5 85.09,49.53 86.36,48.26 86.36,30.48 85.09,29.21 IC3.5 85.09,20.32 90.17,15.24 v120.65,15.24 | v129.54,12.7 IBUS.7
IBUS12  (via drill 0.6)
  Top 0.406: v121.92,16.51 129.54,16.51 v132.08,13.97 | IC8.6 87.63,57.15 88.9,58.42 88.9,64.77 86.36,67.31 76.2,67.31 69.85,73.66 v62.23,73.66
  Bottom 0.406: IC8.6 87.63,49.53 90.17,46.99 IC3.14 90.17,31.75 88.9,30.48 88.9,19.05 91.44,16.51 v121.92,16.51 | v132.08,13.97 IBUS.9 | IC5.13 48.26,73.66 52.07,77.47 58.42,77.47 v62.23,73.66
IBUS13  (via drill 0.6)
  Top 0.406: v120.65,17.78 132.08,17.78 v134.62,15.24 | IC8.7 90.17,57.15 91.44,58.42 91.44,66.04 88.9,68.58 77.47,68.58 71.12,74.93 v58.42,74.93
  Bottom 0.406: IC8.7 90.17,49.53 91.44,48.26 91.44,30.48 90.17,29.21 IC3.7 90.17,20.32 92.71,17.78 v120.65,17.78 | v134.62,15.24 IBUS.11 | IC5.14 50.8,73.66 52.07,74.93 v58.42,74.93
IBUS14  (via drill 0.6)
  Top 0.406: v137.16,16.51 134.62,19.05 v121.92,19.05 | IC8.8 92.71,57.15 93.98,58.42 93.98,67.31 91.44,69.85 78.74,69.85 72.39,76.2 55.88,76.2 53.34,73.66 IC5.15
  Bottom 0.406: IC8.8 92.71,49.53 95.25,46.99 IC3.12 95.25,31.75 93.98,30.48 93.98,21.59 96.52,19.05 v121.92,19.05 | v137.16,16.51 IBUS.13
IBUS15  (via drill 0.6)
  Top 0.406: v120.65,20.32 137.16,20.32 v139.7,17.78 | IC5.17 55.88,86.36 57.15,85.09 90.17,85.09 93.98,81.28 v101.6,81.28 | v101.6,63.5 v101.6,73.66 | v99.06,58.42 96.52,58.42 95.25,57.15 IC8.9
  Bottom 0.406: IC8.9 95.25,49.53 96.52,48.26 96.52,30.48 95.25,29.21 IC3.9 95.25,21.59 96.52,20.32 v120.65,20.32 | v139.7,17.78 IBUS.15 | v101.6,73.66 v101.6,81.28 | v99.06,58.42 101.6,60.96 v101.6,63.5
IS_ROLL
  Bottom 0.406: ALU_B.3 46.99,95.25 50.8,91.44 IC5.19
LATCH_A  (via drill 0.6)
  Top 0.406: v119.38,64.77 142.24,64.77 143.51,63.5 IC7.11
  Bottom 0.406: IC8.11 97.79,63.5 99.06,64.77 v119.38,64.77
ROLL_L_OUT
  Bottom 0.406: ALU_B.4 46.99,92.71 49.53,90.17 49.53,86.36 50.8,85.09 52.07,85.09 53.34,86.36 IC5.18
VCC
  pour Top (isolate 0.508, no thermals): 20.32,8.89 19.05,7.62 19.05,5.08 20.32,3.81 22.86,3.81 24.13,5.08 24.13,7.62 22.86,8.89
  pour Top (isolate 0.61, rank 6, no thermals): 0,100.33 0,0 160.02,0 160.02,100.33

### Text on the board
Top: (c) 2011 AlexiosC
Bottom: (c) 2011 AlexiosC
tNames: UROM02 | (c) 2011 AlexiosC | UROM01 | UROM00 | http://www.bedroomlan.org/hardware/cft | CFT CPU ALU Binary Ops/Port B Rev B
tValues: +12V | +5V | GND